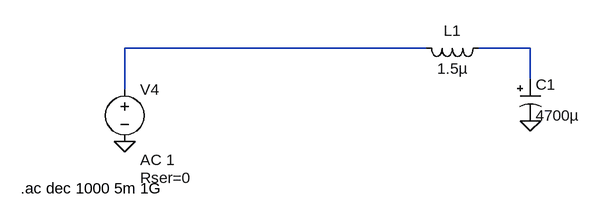
[diagram p0: schematic power_supplies.asc]
power_supplies.asc, the LTspice schematic file:
Version 4
SHEET 1 1032 712
WIRE 80 480 -384 480
WIRE 240 480 160 480
WIRE 240 528 240 480
WIRE -384 544 -384 480
FLAG -384 624 0
FLAG 240 592 0
SYMBOL voltage -384 528 R0
WINDOW 3 24 152 Left 2
WINDOW 123 24 124 Left 2
WINDOW 39 24 152 Left 2
SYMATTR Value ""
SYMATTR Value2 AC 1
SYMATTR SpiceLine Rser=0
SYMATTR InstName V4
SYMBOL ind 176 464 R90
WINDOW 0 5 56 VBottom 2
WINDOW 3 32 56 VTop 2
SYMATTR InstName L1
SYMATTR Value 1.5µ
SYMATTR SpiceLine Ipk=18.2 Rser=0.0024 Rpar=141.3 Cpar=0 mfg="Coilcraft" pn="PCV-1-152-15"
SYMBOL polcap 224 528 R0
WINDOW 3 24 56 Left 2
SYMATTR Value 4700µ
SYMATTR InstName C1
SYMATTR Description Capacitor
SYMATTR Type cap
SYMATTR SpiceLine V=35 Irms=2.03 Rser=0.1 Lser=0
TEXT -544 696 Left 2 !.ac dec 1000 5m 1G

The netlist it stands for:
* power_supplies.asc
V4 N001 0 AC 1 Rser=0
L1 N002 N001 1.5µ Ipk=18.2 Rser=0.0024 Rpar=141.3 Cpar=0 mfg="Coilcraft" pn="PCV-1-152-15"
C1 N002 0 4700µ V=35 Irms=2.03 Rser=0.1 Lser=0
.ac dec 1000 5m 1G
.backanno
.end